# EAGLE design Desk Clock v1.0 (EAGLE 7.5.0)
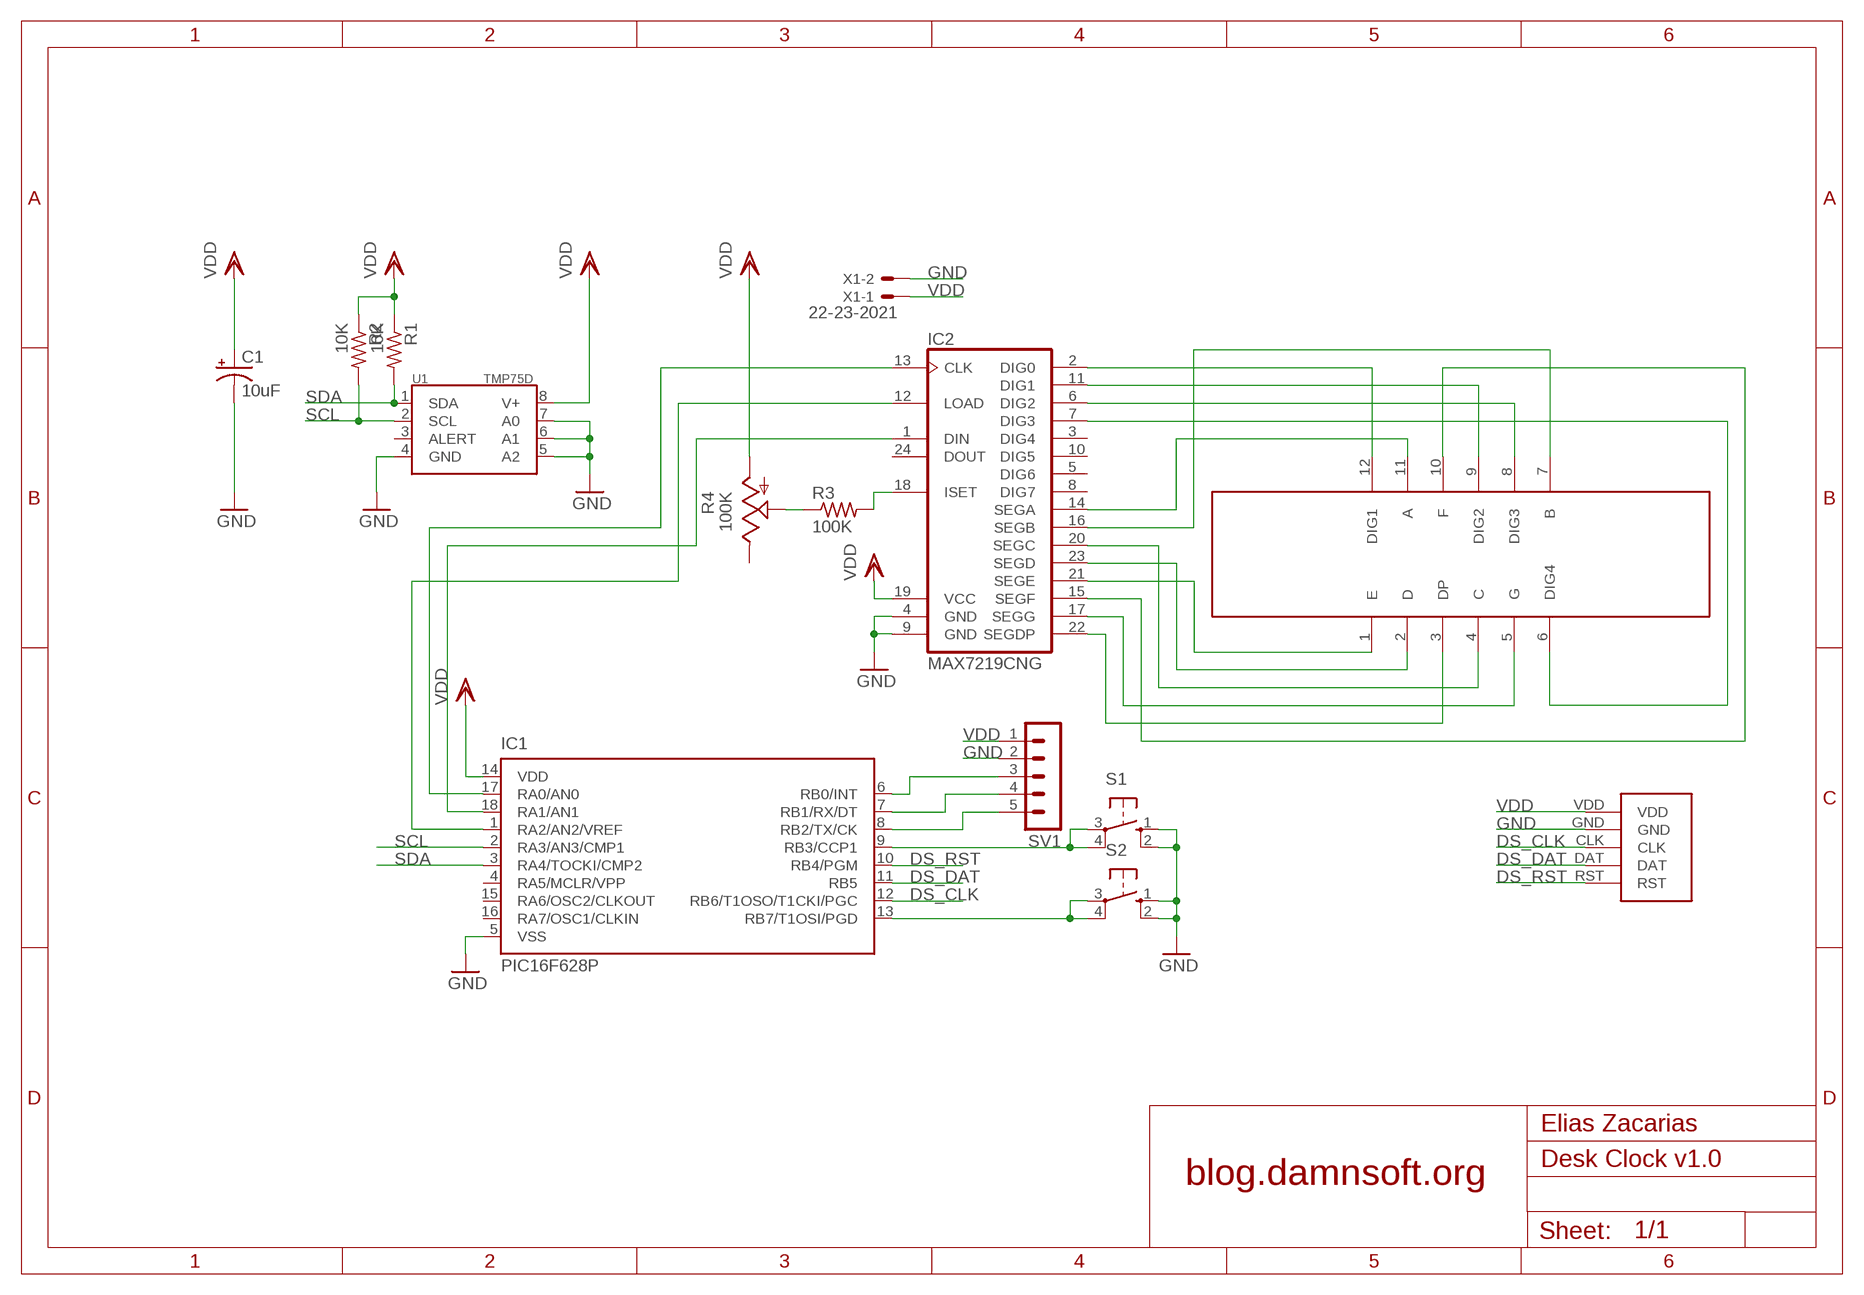
[diagram p0: schematic, sheet 1]

## Parts
C1  10uF  CPOL-USE2-4  [E2-4]
IC1  PIC16F628P  [DIL18]
IC2  MAX7219CNG  [DIL24-3]
R1  10K  R-US_0207/10  [0207/10]
R2  10K  R-US_0207/10  [0207/10]
R3  100K  R-US_0207/10  [0207/10]
R4  100K  TRIM_US-CA6V  [CA6V]
S1  10-XX  [B3F-10XX]
S2  10-XX  [B3F-10XX]
SV1  MA05-1  [MA05-1]
U1  TMP75D  [SO-08]
U$1  NFD-5642BX  [DISPLAY]
U$2  DS1302_BOARD  [DS1302_BOARD]
X1  22-23-2021  [22-23-2021]

## Nets
DS_CLK: IC1.12(RB6/T1OSO/T1CKI/PGC) U$2.CLK
DS_DAT: IC1.11(RB5) U$2.DAT
DS_RST: IC1.10(RB4/PGM) U$2.RST
GND: C1.- IC1.5(VSS) IC2.4(GND) IC2.9(GND) S1.1(S) S1.2(S1) S2.1(S) S2.2(S1) SV1.2 U1.4(GND) U1.5(A2) U1.6(A1) U1.7(A0) U$2.GND X1.2
N$1: IC2.2(DIG0) U$1.12(DIG1)
N$2: IC2.11(DIG1) U$1.9(DIG2)
N$3: IC2.6(DIG2) U$1.8(DIG3)
N$4: IC2.22(SEGDP) U$1.3(DP)
N$5: IC2.17(SEGG) U$1.5(G)
N$6: IC2.7(DIG3) U$1.6(DIG4)
N$7: IC2.14(SEGA) U$1.11(A)
N$8: IC2.15(SEGF) U$1.10(F)
N$9: IC1.9(RB3/CCP1) S1.3(P) S1.4(P1)
N$10: IC2.16(SEGB) U$1.7(B)
N$11: IC2.20(SEGC) U$1.4(C)
N$12: IC2.23(SEGD) U$1.2(D)
N$13: IC2.21(SEGE) U$1.1(E)
N$14: IC2.18(ISET) R3.2
N$15: R3.1 R4.S
N$16: IC1.8(RB2/TX/CK) SV1.5
N$17: IC1.7(RB1/RX/DT) SV1.4
N$18: IC1.6(RB0/INT) SV1.3
N$19: IC1.17(RA0/AN0) IC2.13(CLK)
N$20: IC1.13(RB7/T1OSI/PGD) S2.3(P) S2.4(P1)
N$21: IC1.18(RA1/AN1) IC2.1(DIN)
N$22: IC1.1(RA2/AN2/VREF) IC2.12(LOAD)
SCL: IC1.2(RA3/AN3/CMP1) R2.2 U1.2(SCL)
SDA: IC1.3(RA4/TOCKI/CMP2) R1.2 U1.1(SDA)
VDD: C1.+ IC1.14(VDD) IC2.19(VCC) R1.1 R2.1 R4.A SV1.1 U1.8(V+) U$2.VDD X1.1
Unconnected: IC1.4(RA5/MCLR/VPP) IC1.15(RA6/OSC2/CLKOUT) IC1.16(RA7/OSC1/CLKIN) IC2.3(DIG4) IC2.5(DIG6) IC2.8(DIG7) IC2.10(DIG5) IC2.24(DOUT) R4.E U1.3(ALERT)

## Notes on the sheet
- Elias Zacarias
- blog.damnsoft.org

## Library data of the parts
C1 = rcl:CPOL-US: POLARIZED CAPACITOR, American symbol
IC1 = microchip:PIC16F62*: FLASH-Based 8-Bit CMOS Microcontroller Source: http://ww1.microchip.com/downloads/en/DeviceDoc/40300C.pdf; MF: MICROCHIP; MPN: PIC16F628-04I/P; OC_FARNELL: 9760407; OC_NEWARK: 19C7272
IC2 = maxim:MAX7219CNG: LED DISPLAY DRIVER; MF: MAXIM; MPN: MAX7219CNG; OC_FARNELL: 1523914; OC_NEWARK: 34C4018
R1-R3 = resistor:R-US_: RESISTOR, American symbol
R4 = pot:TRIM_US-: POTENTIOMETER
S1 S2 = switch-omron:10-XX: OMRON SWITCH; MPN: B3F-1000; OC_FARNELL: 176432; OC_NEWARK: 36M3542
SV1 = con-lstb:MA05-1: PIN HEADER; OC_FARNELL: unknown; OC_NEWARK: unknown
U1 = ti_tmp:TMP75
U$1 = NFD-5642Xx:NFD-5642BX
U$2 = DS1302_board:DS1302_BOARD
X1 = con-molex:22-23-2021: .100" (2.54mm) Center Header - 2 Pin; MF: MOLEX; MPN: 22-23-2021; OC_FARNELL: 1462926; OC_NEWARK: 25C3832

## Board
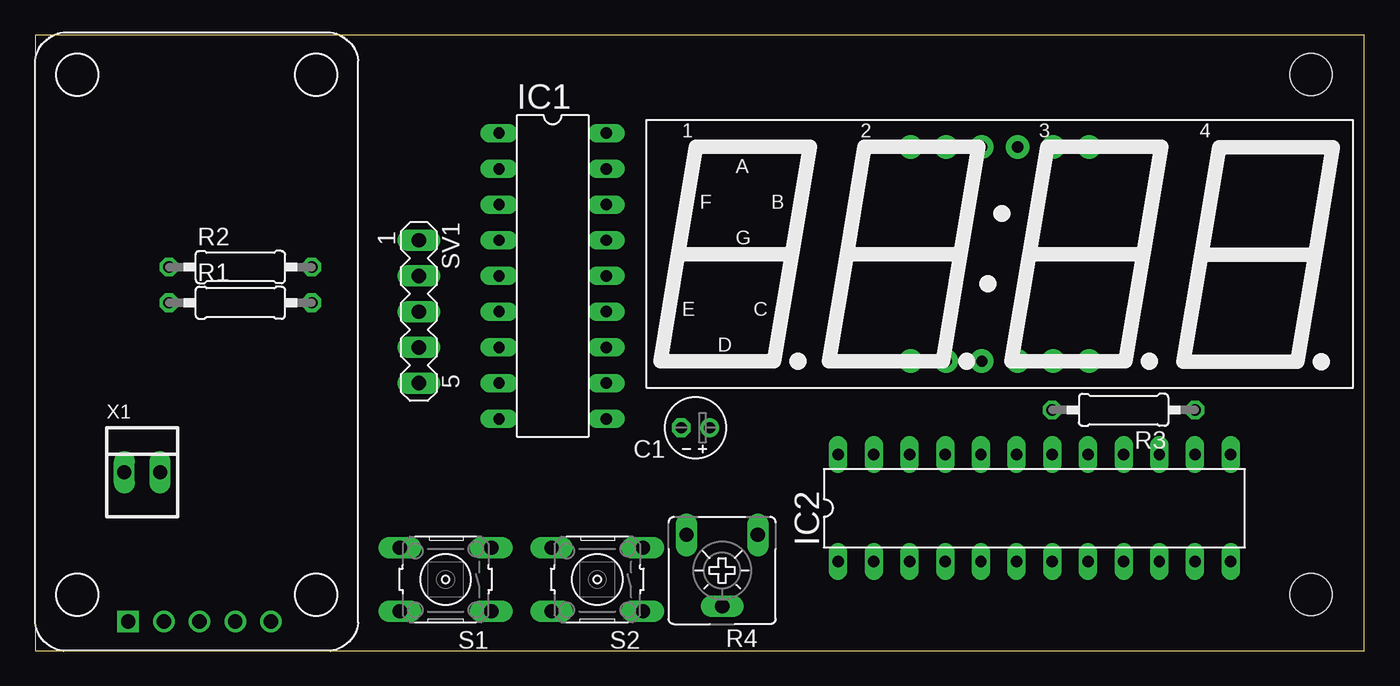
[diagram p1: board, top side]
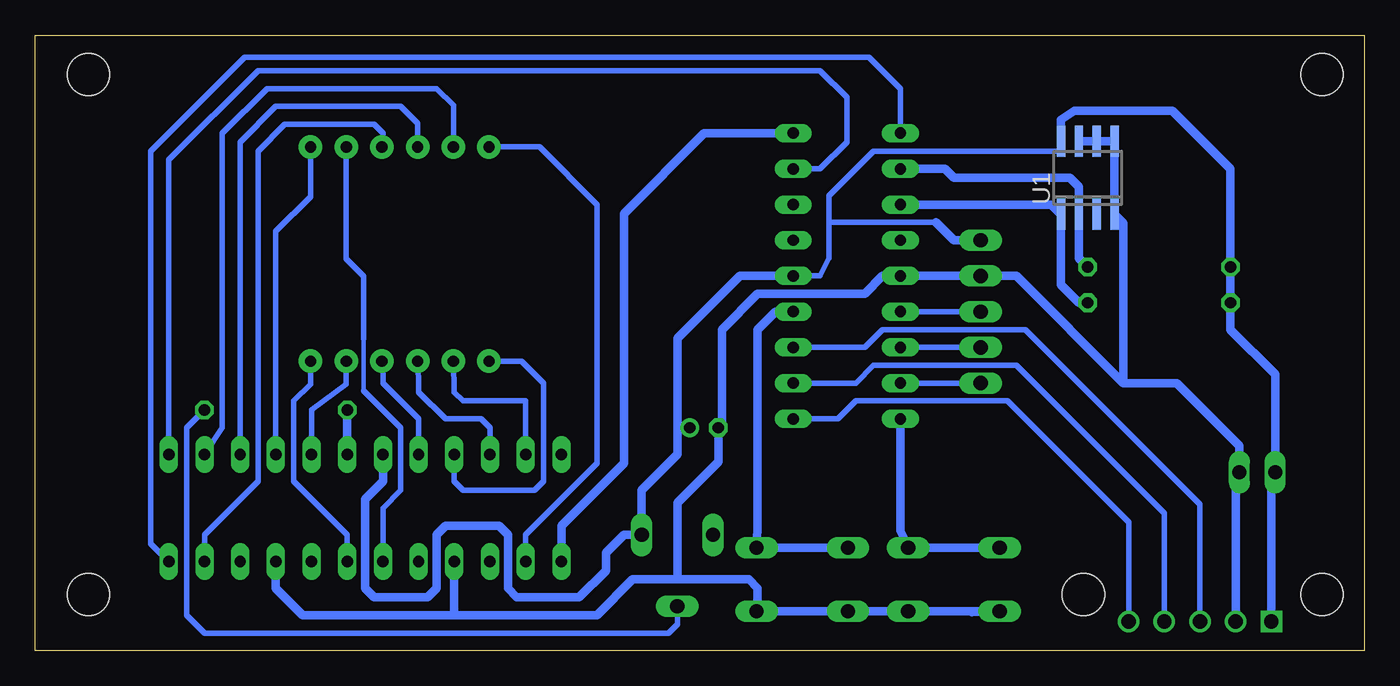
[diagram p2: board, bottom side, seen from below]

Size 94.6 x 43.8 mm. Coordinates in mm from the lower left corner, seen from the top.
Outline: 0,0 94.6,0 94.6,43.8 0,43.8 0,0
Copper layers (1*16): Top 0.035mm / dielectric 1.5mm / Bottom 0.035mm
Design rules "default": minimum track width 10mil, minimum drill 24mil, track to track 8mil, track to pad 8mil, pad to pad 8mil, via to via 8mil, smd to smd 8mil, copper to edge 40mil, drill to drill 8mil, minimum pad ring 10mil, minimum via ring 8mil, stop-mask expansion 4mil, vias tented up to drill 0mil, thermal gap 10mil
Holes 3 mm at 90.81,4 90.81,41 3,4 20,4 3,41

### Footprints (pad centres in the part's own frame; a part is rotated, then mirrored left to right if it is on the bottom)
E2-4 = drill 0.813 pad 1.27: + -1.016,0 | drill 0.813 pad 1.27 octagon: - 1.016,0
DIL18 = drill 0.813 long: 1 -10.16,-3.81; 2 -7.62,-3.81; 3 -5.08,-3.81; 4 -2.54,-3.81; 5 0,-3.81; 6 2.54,-3.81; 7 5.08,-3.81; 8 7.62,-3.81; 9 10.16,-3.81; 10 10.16,3.81; 11 7.62,3.81; 12 5.08,3.81; 13 2.54,3.81; 14 0,3.81; 15 -2.54,3.81; 16 -5.08,3.81; 17 -7.62,3.81; 18 -10.16,3.81
DIL24-3 = drill 0.813 long: 1 -13.97,-3.81; 2 -11.43,-3.81; 3 -8.89,-3.81; 4 -6.35,-3.81; 5 -3.81,-3.81; 6 -1.27,-3.81; 7 1.27,-3.81; 8 3.81,-3.81; 9 6.35,-3.81; 10 8.89,-3.81; 11 11.43,-3.81; 12 13.97,-3.81; 13 13.97,3.81; 14 11.43,3.81; 15 8.89,3.81; 16 6.35,3.81; 17 3.81,3.81; 18 1.27,3.81; 19 -1.27,3.81; 20 -3.81,3.81; 21 -6.35,3.81; 22 -8.89,3.81; 23 -11.43,3.81; 24 -13.97,3.81
0207/10 = drill 0.813 octagon: 1 -5.08,0; 2 5.08,0
CA6V = drill 1.016 long: A -2.54,-2.54; E 2.54,-2.54; S 0,2.54
B3F-10XX = drill 1.016 long: 1 -3.251,2.261; 2 3.251,2.261; 3 -3.251,-2.261; 4 3.251,-2.261
MA05-1 = drill 1.016 long: 1 -5.08,0; 2 -2.54,0; 3 0,0; 4 2.54,0; 5 5.08,0
SO-08 = smd 0.6 x 2.2: 1 -1.905,-2.6; 2 -0.635,-2.6; 3 0.635,-2.6; 4 1.905,-2.6; 5 1.905,2.6; 6 0.635,2.6; 7 -0.635,2.6; 8 -1.905,2.6
DISPLAY = drill 0.8 pad 1.676: 1 18.8,1.88; 2 21.34,1.88; 3 23.88,1.88; 4 26.42,1.88; 5 28.96,1.88; 6 31.5,1.88; 7 31.5,17.12; 8 28.96,17.12; 9 26.42,17.12; 10 23.88,17.12; 11 21.34,17.12; 12 18.8,17.12
DS1302_BOARD = drill 1.016: CLK 11.7,2.08; DAT 14.24,2.08; GND 9.16,2.08; RST 16.78,2.08 | drill 1.016 square: VDD 6.62,2.08
22-23-2021 = drill 1 long: 1 -1.27,0; 2 1.27,0

### Placement (x,y rotation side)
C1  46.99,15.88 180 top
IC1  36.83,26.67 270 top
IC2  71.12,10.16 0 top
R1  14.61,24.76 0 top
R2  14.61,27.3 0 top
R3  77.47,17.14 180 top
R4  48.9,5.71 180 top
S1  29.21,5.08 180 top
S2  40.01,5.08 180 top
SV1  27.3,24.13 270 top
U1  19.68,33.66 0 bottom
U$1  43.5,18.73 0 top
U$2  0,0 0 top
X1  7.62,12.7 0 top

### Tracks (layer width: path | path; a pad name or v marks a point on that pad's centre or on a via)
DS_CLK
  Bottom 0.406: IC1.12 35.56,21.59 34.29,22.86 24.13,22.86 11.7,10.43 U$2.CLK
DS_DAT
  Bottom 0.406: IC1.11 36.2,19.05 34.92,20.32 24.77,20.32 14.24,9.79 U$2.DAT
DS_RST
  Bottom 0.406: IC1.10 37.47,16.51 36.2,17.78 25.4,17.78 16.78,9.16 U$2.RST
GND
  Bottom 0.61: IC2.9 77.47,4.45 75.56,2.54 64.77,2.54 | IC2.4 64.77,2.54 | U1.7 U1.6 U1.5 U1.4 17.14,30.42 17.14,19.05 | 17.14,19.05 24.77,26.67 SV1.2 IC1.5 34.29,26.67 35.56,25.4 43.18,25.4 45.72,22.86 45.72,16.13 C1.- 45.97,13.46 48.9,10.54 48.9,5.08 | U$2.GND 9.16,13.61 X1.2 8.89,14.61 13.34,19.05 17.14,19.05 | 64.77,2.54 54.61,2.54 52.07,5.08 48.9,5.08 | 48.9,5.08 43.81,5.08 43.18,4.45 43.18,2.9 S2.1 S2.2 S1.1 S1.2 27.94,2.74
N$1
  Bottom 0.406: U$1.12 58.71,35.85 54.61,31.75 54.61,13.34 59.69,8.26 IC2.2
N$2
  Bottom 0.406: IC2.11 82.55,8.26 78.74,12.06 78.74,35.56 76.83,37.47 70.48,37.47 69.85,36.83 69.85,35.92 U$1.9
N$3
  Bottom 0.305: 71.22,22.19 71.22,18.51
  Bottom 0.406: IC2.6 69.85,10.16 68.58,11.43 68.58,15.88 71.22,18.51 | U$1.8 72.46,27.88 71.22,26.64 71.22,22.19
N$4
  Bottom 0.406: IC2.22 62.23,15.88 62.87,16.51 65.41,16.51 67.31,18.41 67.31,19.27 U$1.3
N$5
  Bottom 0.406: U$1.5 72.46,18.98 74.93,17.14 IC2.17
N$6
  Bottom 0.406: U$1.6 75,18.98 76.2,17.78 76.2,12.06 72.39,8.26 IC2.7
N$7
  Bottom 0.406: U$1.11 64.84,38.8 66.04,40.01 78.11,40.01 81.28,36.83 81.28,15.88 IC2.14
N$8
  Bottom 0.406: U$1.10 67.38,37.53 68.58,38.73 77.47,38.73 80.01,36.2 IC2.15
N$9
  Bottom 0.61: S1.4 S1.3 33.02,8.53 IC1.9
N$10
  Bottom 0.406: U$1.7 75,32.32 77.47,29.84 IC2.16
N$11
  Bottom 0.406: IC2.20 67.31,16.51 69.85,19.05 69.85,20.54 U$1.4
N$12
  Bottom 0.406: IC2.23 59.69,17.78 64.14,17.78 64.77,18.41 U$1.2
N$13
  Bottom 0.406: IC2.21 64.77,12.06 64.14,11.43 59.05,11.43 58.42,12.06 58.42,19.05 59.98,20.61 U$1.1
N$14
  Bottom 0.61: R3.2 IC2.18
N$15
  Bottom 0.406: R3.1 83.82,15.88 83.82,2.54 82.55,1.27 49.53,1.27 48.9,1.91 R4.S
N$16
  Bottom 0.406: SV1.5 IC1.8
N$17
  Bottom 0.406: SV1.4 IC1.7
N$18
  Bottom 0.406: SV1.3 IC1.6
N$19
  Bottom 0.406: IC1.17 38.73,34.29 36.83,36.2 36.83,39.37 38.73,41.27 78.74,41.27 85.09,34.93 IC2.13
N$20
  Bottom 0.61: IC1.13 41.91,24.13 43.18,22.86 43.18,8.69 S2.3 S2.4
N$21
  Bottom 0.61: IC1.18 46.99,36.83 52.7,31.11 52.7,13.34 57.15,8.89 IC2.1
N$22
  Bottom 0.406: IC1.1 33.02,40.01 35.24,42.23 79.69,42.23 86.36,35.56 86.36,7.62 IC2.12
SCL
  Bottom 0.61: R2.2 20.32,27.94 U1.2 20.32,33.02 20.95,33.66 29.21,33.66 29.84,34.29 IC1.2
SDA
  Bottom 0.61: R1.2 20.32,24.76 21.59,26.04 U1.1 22.29,31.75 IC1.3
VDD
  Bottom 0.406: IC1.14 38.73,26.67 38.1,27.94 38.1,30.48 | 38.1,30.48 38.1,32.39 34.92,35.56 21.65,35.56 U1.8 | 30.48,30.48 38.1,30.48
  Bottom 0.61: U$2.VDD 6.62,13.61 X1.1 6.35,19.68 9.53,22.86 R1.1 R2.1 9.53,34.29 13.65,38.42 20.64,38.42 21.59,37.78 U1.8 | SV1.1 29.21,29.21 30.48,30.48 | IC1.14 44.45,26.67 48.9,22.22 48.9,15.88 | 48.9,15.88 48.9,13.97 51.44,11.43 R4.A 52.7,8.26 53.98,6.99 53.98,5.71 55.88,3.81 60.33,3.81 60.96,4.45 60.96,8.26 61.59,8.89 65.41,8.89 66.04,8.26 66.04,4.45 66.67,3.81 70.48,3.81 71.12,4.45 71.12,10.79 69.85,12.06 IC2.19 | C1.+ 48.9,15.88